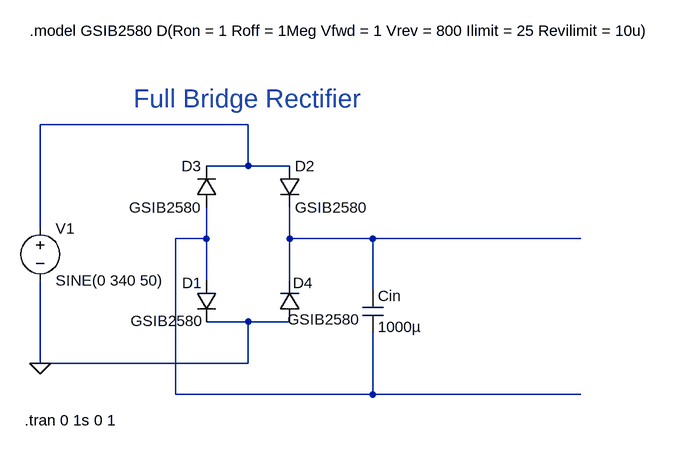
[diagram p0: schematic Full Bridge Rectifier.asc]
Full Bridge Rectifier.asc, the LTspice schematic file:
Version 4
SHEET 1 2744 1288
WIRE 368 -16 48 -16
WIRE 368 48 368 -16
WIRE 368 48 304 48
WIRE 432 48 368 48
WIRE 48 144 48 -16
WIRE 304 160 304 112
WIRE 304 160 256 160
WIRE 432 160 432 112
WIRE 560 160 432 160
WIRE 880 160 560 160
WIRE 304 224 304 160
WIRE 432 224 432 160
WIRE 560 240 560 160
WIRE 368 288 304 288
WIRE 432 288 368 288
WIRE 48 352 48 224
WIRE 368 352 368 288
WIRE 368 352 48 352
WIRE 256 400 256 160
WIRE 560 400 560 304
WIRE 560 400 256 400
WIRE 880 400 560 400
FLAG 48 352 0
SYMBOL voltage 48 128 R0
WINDOW 123 0 0 Left 0
WINDOW 39 0 0 Left 0
SYMATTR InstName V1
SYMATTR Value SINE(0 340 50)
SYMBOL diode 288 224 R0
WINDOW 0 -22 4 Left 2
WINDOW 3 141 60 Left 2
SYMATTR InstName D1
SYMATTR Value GSIB2580
SYMBOL diode 416 48 R0
SYMATTR InstName D2
SYMATTR Value GSIB2580
SYMBOL diode 320 112 R180
WINDOW 0 24 64 Left 2
WINDOW 3 24 0 Left 2
SYMATTR InstName D3
SYMATTR Value GSIB2580
SYMBOL diode 448 288 R180
WINDOW 0 -20 60 Left 2
WINDOW 3 150 1 Left 2
SYMATTR InstName D4
SYMATTR Value GSIB2580
SYMBOL cap 544 240 R0
SYMATTR InstName Cin
SYMATTR Value 1000µ
SYMATTR SpiceLine V=250
TEXT 192 -56 Left 4 ;Full Bridge Rectifier
TEXT 24 440 Left 2 !.tran 0 1s 0 1
TEXT 32 -160 Left 2 !.model GSIB2580 D(Ron = 1 Roff = 1Meg Vfwd = 1 Vrev = 800 Ilimit = 25 Revilimit = 10u)

The netlist it stands for:
* Full Bridge Rectifier.asc
V1 N001 0 SINE(0 340 50)
D1 N002 0 GSIB2580
D2 N001 N003 GSIB2580
D3 N002 N001 GSIB2580
D4 0 N003 GSIB2580
Cin N003 N002 1000µ V=250
.model D D
.lib standard.dio
* Full Bridge Rectifier
.tran 0 1s 0 1
.model GSIB2580 D(Ron = 1 Roff = 1Meg Vfwd = 1 Vrev = 800 Ilimit = 25 Revilimit = 10u)
.backanno
.end